# EAGLE schematic USBSmartSwitch (EAGLE 9.3.0)
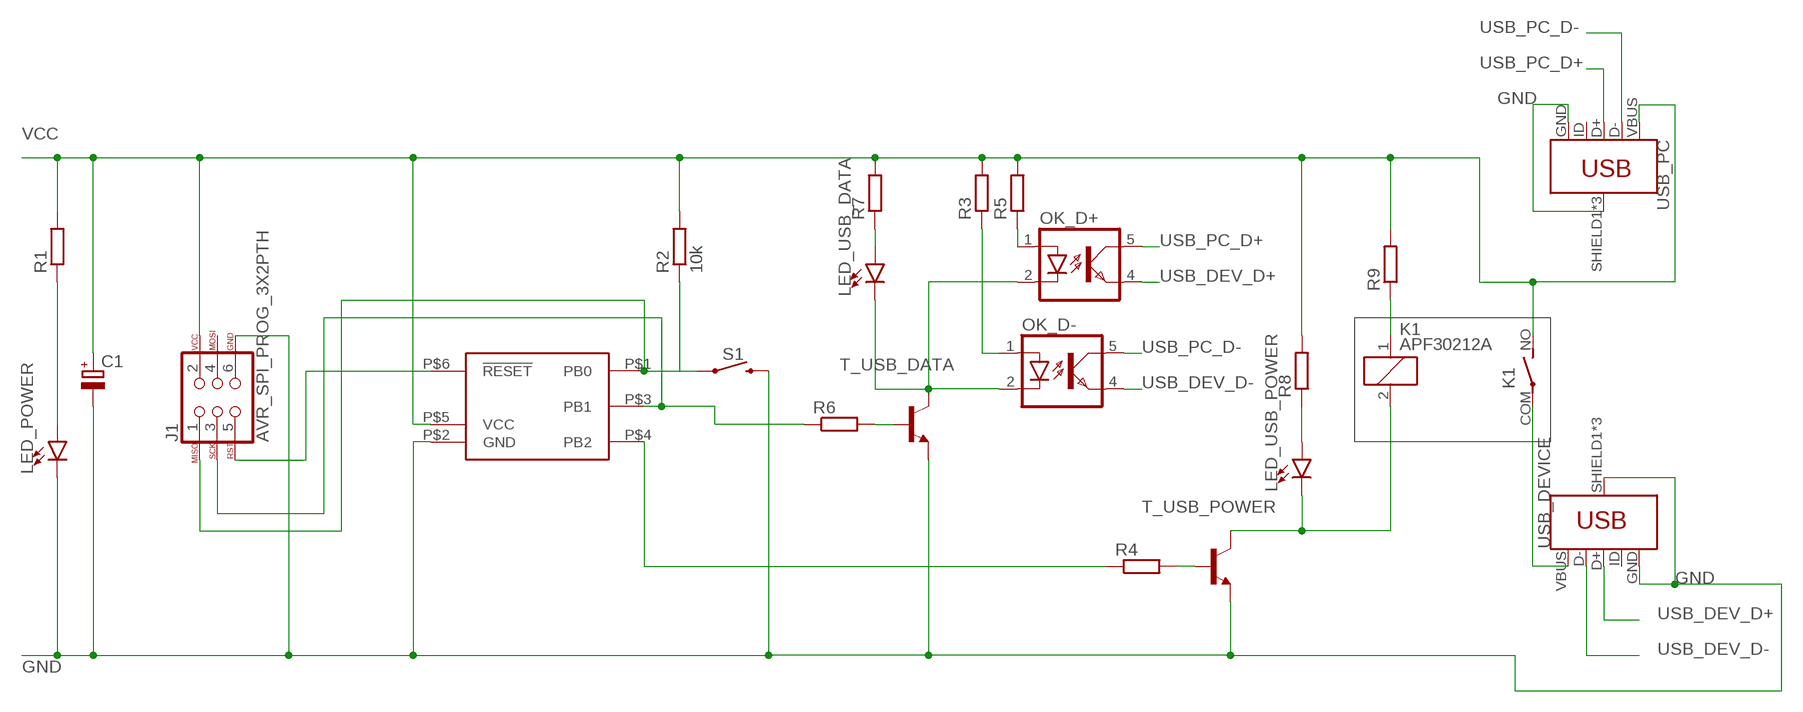
[diagram p0: schematic, sheet 1]

## Parts
C1  CPOL-EUE2-5  [E2-5]
J1  AVR_SPI_PROG_3X2PTH  [2X3]
K1  APF30212A  [APF30212A]
LED_POWER  LED3MM  [LED_3MM]
LED_USB_DATA  LED3MM  [LED_3MM]
LED_USB_POWER  LED3MM  [LED_3MM]
OK_D+  CNF17GF  [DIL06B]
OK_D-  CNF17GF  [DIL06B]
R1  R-EU_0204/7  [0204/7]
R2  10k  R-EU_0204/7  [0204/7]
R3  R-EU_0204/7  [0204/7]
R4  R-EU_0204/7  [0204/7]
R5  R-EU_0204/7  [0204/7]
R6  R-EU_0204/7  [0204/7]
R7  R-EU_0204/7  [0204/7]
R8  R-EU_0204/7  [0204/7]
R9  R-EU_0204/7  [0204/7]
S1  MOMENTARY-SWITCH-SPST-PTH-6.0MM  [TACTILE_SWITCH_PTH_6.0MM]
T_USB_DATA  -NPN-TO92  [TO92]
T_USB_POWER  -NPN-TO92  [TO92]
U$1  ATTINY10  [SOT23]
USB_DEVICE  USB_MICRO-BREDUCED_PASTE  [USB-B-MICRO-SMD_RED_PASTE]
USB_PC  USB_MICRO-BREDUCED_PASTE  [USB-B-MICRO-SMD_RED_PASTE]

## Nets
GND: C1.- J1.6 LED_POWER.K(C) S1.3 T_USB_DATA.1(E) T_USB_POWER.1(E) U$1.P$2(GND) USB_DEVICE.GND USB_DEVICE.SHIELD1(SHIELD) USB_DEVICE.SHIELD2(SHIELD) USB_DEVICE.SHIELD3(SHIELD) USB_PC.GND USB_PC.SHIELD1(SHIELD) USB_PC.SHIELD2(SHIELD) USB_PC.SHIELD3(SHIELD)
N$1: LED_POWER.A R1.1
N$2: J1.1 R2.1 S1.1 U$1.P$1(PB0)
N$3: J1.5 U$1.P$6(!RESET)
N$4: R6.2 T_USB_DATA.2(B)
N$5: J1.3 R6.1 U$1.P$3(PB1)
N$6: OK_D+.1(A) R5.1
N$7: OK_D-.1(A) R3.1
N$8: LED_USB_DATA.K(C) OK_D+.2(C) OK_D-.2(C) T_USB_DATA.3(C)
N$9: R4.1 U$1.P$4(PB2)
N$10: LED_USB_DATA.A R7.1
N$11: R4.2 T_USB_POWER.2(B)
N$12: LED_USB_POWER.A R8.1
N$13: K1.2 LED_USB_POWER.K(C) T_USB_POWER.3(C)
N$15: K1.1 R9.1
N$21: K1.COM(2:P) USB_DEVICE.VBUS
USB_DEV_D+: OK_D+.4(EMIT) USB_DEVICE.D+
USB_DEV_D-: OK_D-.4(EMIT) USB_DEVICE.D-
USB_PC_D+: OK_D+.5(COL) USB_PC.D+
USB_PC_D-: OK_D-.5(COL) USB_PC.D-
VCC: C1.+ J1.2 K1.NO(2:S) R1.2 R2.2 R3.2 R5.2 R7.2 R8.2 R9.2 U$1.P$5(VCC) USB_PC.VBUS
Unconnected: J1.4 USB_DEVICE.ID USB_PC.ID

## Library data of the parts
C1 = resistor:CPOL-EU: POLARIZED CAPACITOR, European symbol
J1 = SparkFun-Connectors:AVR_SPI_PROG_3X2: AVR ISP 6 Pin This is the reduced ISP connector for AVR programming. Common on Arduino. This footprint will take up less PCB space and can be used with a 10-pin to 6-pin adapter such as SKU: BOB-08508 **Special note about "TEST_POINT" package. The stop mask is on the top side, so if you want your programming test points to be on the bottom of your board, make sure to place this package on the bottom side of the board. This also ensure that the orientation to program from the bottom side will be correct. SparkFun Products: SparkFun ISP Pogo Adapter <https://www.sparkfun.com/products/11591> - NS Tiny AVR Programmer <https://www.sparkfun.com/products/11801> -PTH
K1 = relay:APF30212A: Compliant with European standards 1a/1c 6A Slim power relays Source: Data sheet <http://pewa.panasonic.com/assets/pcsd/catalog/pf-catalog.pdf>; OC_FARNELL: unknown
LED_POWER LED_USB_DATA LED_USB_POWER = SparkFun-LED:LED: LED (Generic) Standard schematic elements and footprints for 5mm, 3mm, 1206, and 0603 sized LEDs. Generic LEDs with no color specified.; PROD_ID: DIO-08794
OK_D+ OK_D- = optocoupler:CNF17GF: HEWLETT PACKARD OPTO COUPLER; OC_FARNELL: unknown; OC_NEWARK: unknown
R1-R9 = resistor:R-EU_: RESISTOR, European symbol
S1 = SparkFun-Switches:MOMENTARY-SWITCH-SPST: Momentary Switch (Pushbutton) - SPST Normally-open (NO) SPST momentary switches (buttons, pushbuttons). Variants PTH-12MM - 12mm square, through-hole Momentary Pushbutton Switch - 12mm Square <https://www.sparkfun.com/products/9190> (COM-09190) PTH-6.0MM, PTH-6.0MM-KIT - 6.0mm square, through-hole Mini Pushbutton Switch <https://www.sparkfun.com/products/97> (COM-00097) KIT package intended for soldering kit's - only one side of pads' copper is exposed. PTH-RIGHT-ANGLE-KIT - Right-angle, through-hole Right Angle Tactile Button <https://www.sparkfun.com/products/10791> - Used on SparkFun BigTime Watch Kit <https://www.sparkfun.com/products/11734> SMD-12MM - 12mm square, surface-mount Tactile Button - SMD (12mm) <https://www.sparkfun.com/products/12993> (COM-12993) Used on SparkFun PicoBoard <https://www.sparkfun.com/products/11888> SMD-4.5MM - 4.5mm Square Trackball Switch Used on SparkFun Blackberry Trackballer Breakout <https://www.sparkfun.com/products/13169> SMD-4.6MMX2.8MM - 4.60mm x 2.80mm, surface mount Used on SparkFun SAMD21 Mini Breakout <https://www.sparkfun.com/products/13664> SMD-5.2MM, SMD-5.2-REDUNDANT - 5.2mm square, surface-mount Mini Pushbutton Switch - SMD <https://www.sparkfun.com/products/8720> (COM-08720) Used on Arduino Pro Mini <https://www.sparkfun.com/products/11114> REDUNDANT package connects both switch circuits together SMD-6.0X3.5MM - 6.0 x 3.5mm, surface mount Momentary Reset Switch SMD <https://www.sparkfun.com/products/8229> (COM-08229) SMD-6.2MM-TALL - 6.2mm square, surface mount Tactile Button - SMD (6mm) <https://www.sparkfun.com/products/12992> Used on SparkFun Digital Sandbox <https://www.sparkfun.com/products/12651> SMD-RIGHT-ANGLE - Right-angle, surface mount Used on SparkFun Block for Intel® Edison - Arduino <https://www.sparkfun.com/products/13036>; PROD_ID: SWCH-08441; SF_SKU: COM-00097
T_USB_DATA T_USB_POWER = transistor:*-NPN-: NPN Transistror BF959 corrected 2008.03.06
U$1 = kalshagar:ATTINY10
USB_DEVICE USB_PC = SparkFun-Connectors:USB_MICRO-B: USB Type Micro-B Connector Male/female and PTH/SMT variants SparkFun Products: SparkFun microB USB Breakout <https://www.sparkfun.com/products/12035> SparkFun USB microB Plug Breakout <https://www.sparkfun.com/products/10031> SparkFun ESP8266 Thing <https://www.sparkfun.com/products/13231>; PROD_ID: CONN-11752